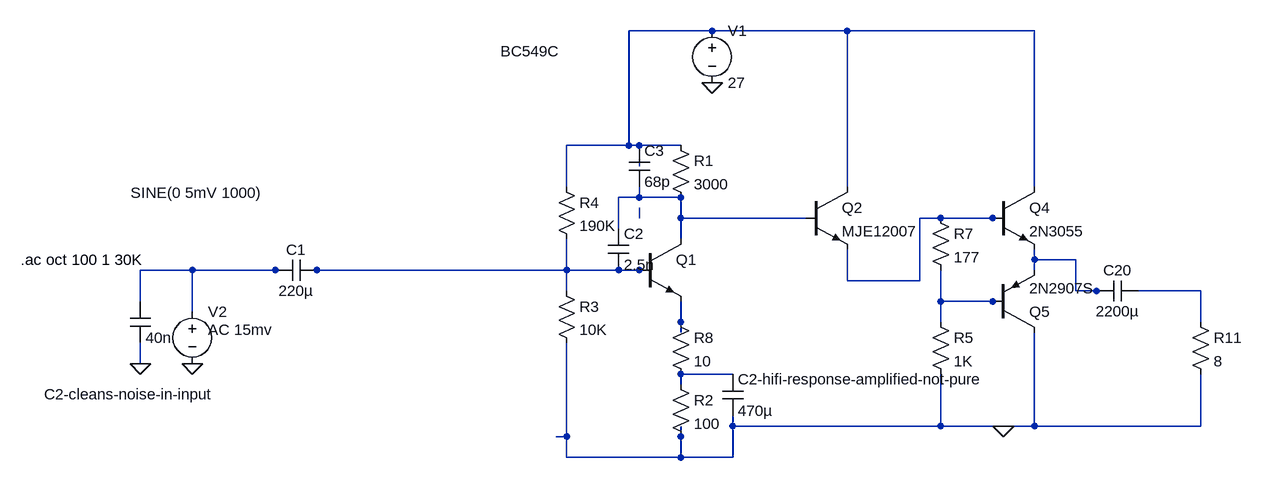
[diagram p0: schematic Bypass cap and feedback push pull.asc]
Bypass cap and feedback push pull.asc, the LTspice schematic file:
Version 4
SHEET 1 1788 680
WIRE 272 -256 144 -256
WIRE 480 -256 272 -256
WIRE 768 -256 480 -256
WIRE 144 -80 144 -256
WIRE 144 -80 48 -80
WIRE 160 -80 144 -80
WIRE 224 -80 160 -80
WIRE 160 -48 160 -80
WIRE 48 -16 48 -80
WIRE 480 -16 480 -256
WIRE 768 -16 768 -256
WIRE 160 0 160 -16
WIRE 160 0 128 0
WIRE 224 0 160 0
WIRE 160 32 160 16
WIRE 224 32 224 0
WIRE 416 32 224 32
WIRE 624 32 592 32
WIRE 704 32 624 32
WIRE 720 32 704 32
WIRE 128 48 128 0
WIRE 224 64 224 32
WIRE 768 96 768 80
WIRE 832 96 768 96
WIRE -528 112 -608 112
WIRE -400 112 -528 112
WIRE -384 112 -400 112
WIRE -336 112 -352 112
WIRE 48 112 48 64
WIRE 48 112 -336 112
WIRE 128 112 48 112
WIRE 160 112 128 112
WIRE 176 112 160 112
WIRE 768 112 768 96
WIRE 480 128 480 80
WIRE 592 128 592 32
WIRE 592 128 480 128
WIRE 48 144 48 112
WIRE 832 144 832 96
WIRE 864 144 832 144
WIRE 880 144 864 144
WIRE 1024 144 928 144
WIRE -608 160 -608 112
WIRE 624 160 624 112
WIRE 704 160 624 160
WIRE 720 160 704 160
WIRE -528 176 -528 112
WIRE 224 192 224 160
WIRE 624 192 624 160
WIRE 1024 192 1024 144
WIRE 224 208 224 192
WIRE -608 256 -608 224
WIRE 304 272 224 272
WIRE 224 288 224 272
WIRE 304 352 304 336
WIRE 624 352 624 272
WIRE 624 352 304 352
WIRE 720 352 624 352
WIRE 768 352 768 208
WIRE 768 352 720 352
WIRE 1024 352 1024 272
WIRE 1024 352 768 352
WIRE 48 368 48 224
WIRE 48 368 32 368
WIRE 224 368 224 352
WIRE 48 400 48 368
WIRE 224 400 224 368
WIRE 224 400 48 400
WIRE 304 400 304 352
WIRE 304 400 224 400
FLAG 272 -176 0
FLAG -528 256 0
FLAG 720 352 0
FLAG -608 256 0
SYMBOL npn 160 64 R0
WINDOW 3 -214 -289 Left 2
SYMATTR Value BC549C
SYMATTR InstName Q1
SYMBOL res 208 -96 R0
SYMATTR InstName R1
SYMATTR Value 3000
SYMBOL voltage 272 -272 R0
WINDOW 123 0 0 Left 2
WINDOW 39 0 0 Left 2
SYMATTR InstName V1
SYMATTR Value 27
SYMBOL res 32 -32 R0
SYMATTR InstName R4
SYMATTR Value 190K
SYMBOL res 32 128 R0
SYMATTR InstName R3
SYMATTR Value 10K
SYMBOL res 208 272 R0
SYMATTR InstName R2
SYMATTR Value 100
SYMBOL cap -336 96 R90
WINDOW 0 0 32 VBottom 2
WINDOW 3 32 32 VTop 2
SYMATTR InstName C1
SYMATTR Value 220µ
SYMBOL voltage -528 160 R0
WINDOW 123 24 44 Left 2
WINDOW 39 24 72 Left 2
WINDOW 3 -95 -167 Left 2
SYMATTR Value2 AC 15mv
SYMATTR Value SINE(0 5mV 1000)
SYMATTR InstName V2
SYMBOL npn2 704 -16 R0
SYMATTR InstName Q4
SYMATTR Value 2N3055
SYMBOL res 1008 176 R0
SYMATTR InstName R11
SYMATTR Value 8
SYMBOL pnp 704 208 M180
SYMATTR InstName Q5
SYMATTR Value 2N2907S
SYMBOL cap 928 128 R90
WINDOW 0 0 32 VBottom 2
WINDOW 3 32 32 VTop 2
SYMATTR InstName C20
SYMATTR Value 2200µ
SYMBOL res 608 176 R0
SYMATTR InstName R5
SYMATTR Value 1K
SYMBOL res 608 16 R0
SYMATTR InstName R7
SYMATTR Value 177
SYMBOL npn 416 -16 R0
SYMATTR InstName Q2
SYMATTR Value MJE12007
SYMBOL cap 288 272 R0
SYMATTR InstName C2-hifi-response-amplified-not-pure
SYMATTR Value 470µ
SYMBOL cap -624 160 R0
WINDOW 0 -132 143 Left 2
SYMATTR InstName C2-cleans-noise-in-input
SYMATTR Value 40n
SYMBOL res 208 176 R0
SYMATTR InstName R8
SYMATTR Value 10
SYMBOL cap 112 48 R0
SYMATTR InstName C2
SYMATTR Value 2.5n
SYMBOL cap 144 -80 R0
SYMATTR InstName C3
SYMATTR Value 68p
TEXT -792 96 Left 2 !.ac oct 100 1 30K

The netlist it stands for:
* Bypass cap and feedback push pull.asc
Q1 N002 N007 N010 0 BC549C
R1 N001 N002 3000
V1 N001 0 27
R4 N001 N007 190K
R3 N007 0 10K
R2 N011 0 100
C1 N007 N006 220µ
V2 N006 0 SINE(0 5mV 1000) AC 15mv
Q4 N001 N004 N005 0 2N3055
R11 N008 0 8
Q5 0 N009 N005 0 2N2907S
C20 N008 N005 2200µ
R5 N009 0 1K
R7 N004 N009 177
Q2 N001 N002 N004 0 MJE12007
C2-hifi-response-amplified-not-pure N011 0 470µ
C2-cleans-noise-in-input N006 0 40n
R8 N010 N011 10
C2 N002 N007 2.5n
C3 N001 N002 68p
.model NPN NPN
.model PNP PNP
.lib standard.bjt
.ac oct 100 1 30K
.backanno
.end